# EAGLE design Grove - Speaker v1.0 (EAGLE 6.3)
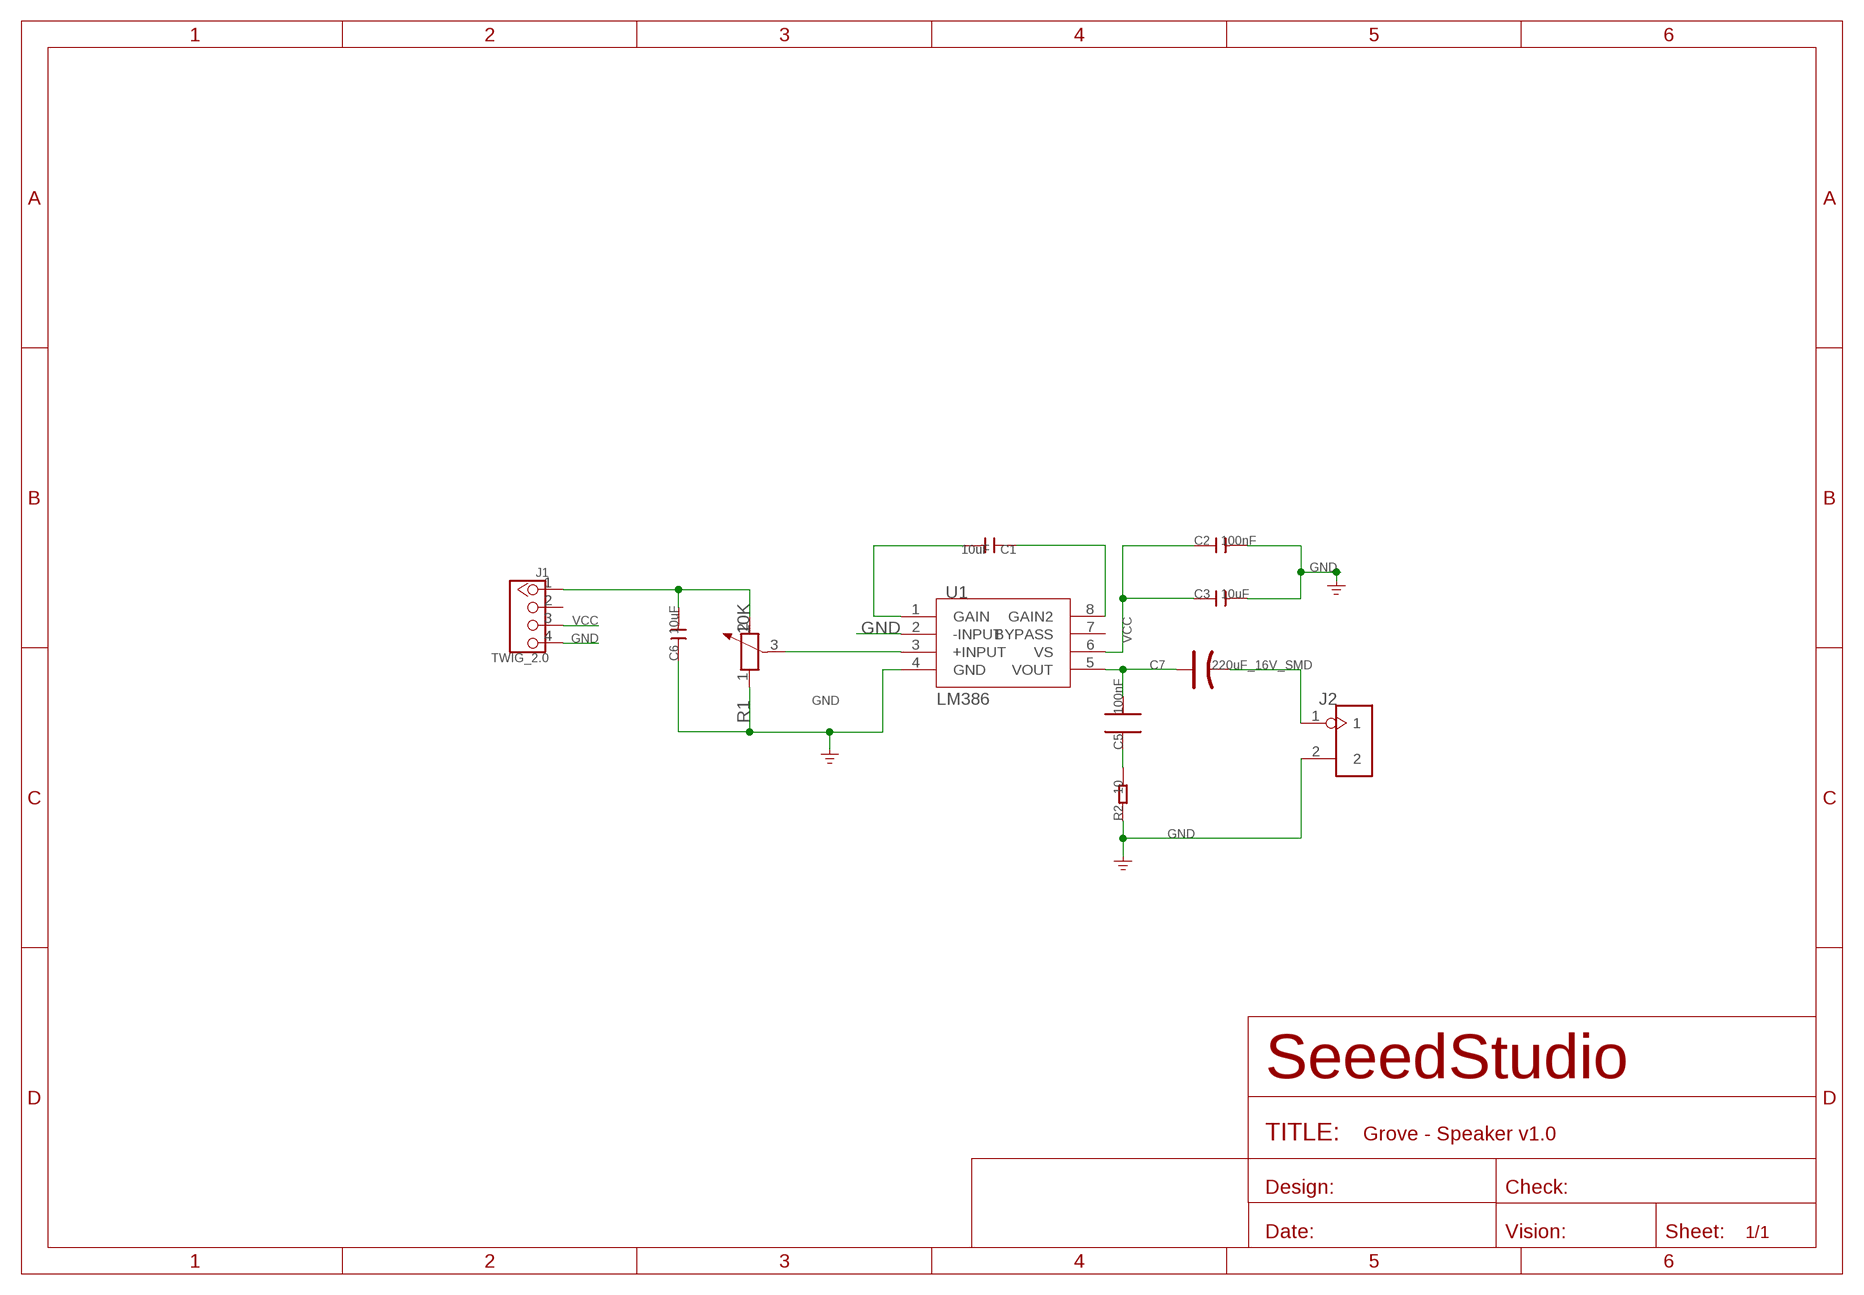
[diagram p0: schematic, sheet 1]

## Parts
C1  10uF  C-0805  [C0805]
C2  100nF  C-0603  [C0603]
C3  10uF  C-0805  [C0805]
C5  100nF  C0603  [0603]
C6  10uF  C-0805  [C0805]
C7  220uF_16V_SMD  CAP-ELECTRO-E  [ELECTRO-SMD-E-7.8MM]
J1  TWIG_2.0  [2.0_1X4]
J2  HEADER-2P-2.0  [2P-2.0]
R1  10K  R-POTENTIOMETER'3362'  [3P-SQUA-7X6.8]
R2  10  R-0603  [R0603]
U1  LM386  [SO08]

## Nets
GND: C2.2 C3.2 C6.1 J1.4 J2.2 R1.1 R2.1 U1.2(-INPUT) U1.4(GND)
N$1: C5.1 R2.2
N$2: C1.1 U1.8(GAIN2)
N$3: C7.- J2.1
N$4: R1.3 U1.3(+INPUT)
N$5: C6.2 J1.1 R1.2
N$6: C5.2 C7.+ U1.5(VOUT)
N$7: C1.2 U1.1(GAIN)
VCC: C2.1 C3.1 J1.3 U1.6(VS)
Unconnected: J1.2 U1.7(BYPASS)

## Library data of the parts
C1-C3 C6 = Discrete:C*: Ceramic Capacitors
C5 = CPT_SMD:C0603; C0603: 100N
C7 = Discrete:CAP*: Electrolytic Capacitors,Tantalum Capacitors and Super Capacitors
J1 = CONNECTER:TWIG_2.0
J2 = Connector:HEADER-2P
R1 = Discrete:R-POTENTIOMETER*: Potentiometer
R2 = Discrete:R*
U1 = seeedleo:LM386

## Board
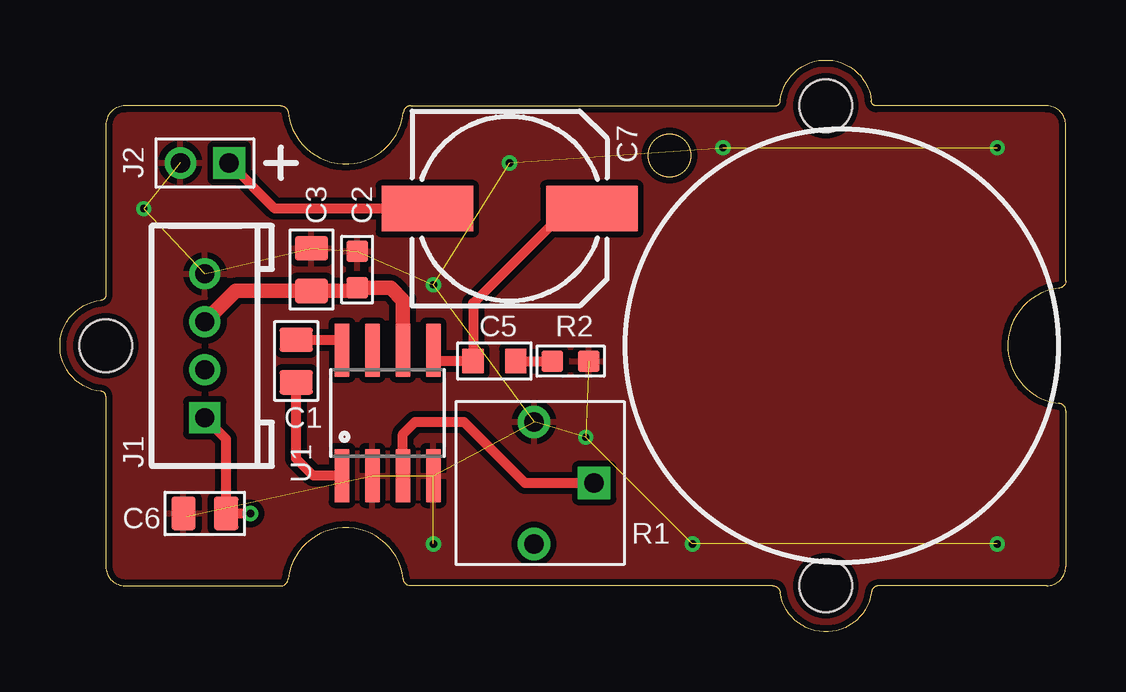
[diagram p1: board, top side]
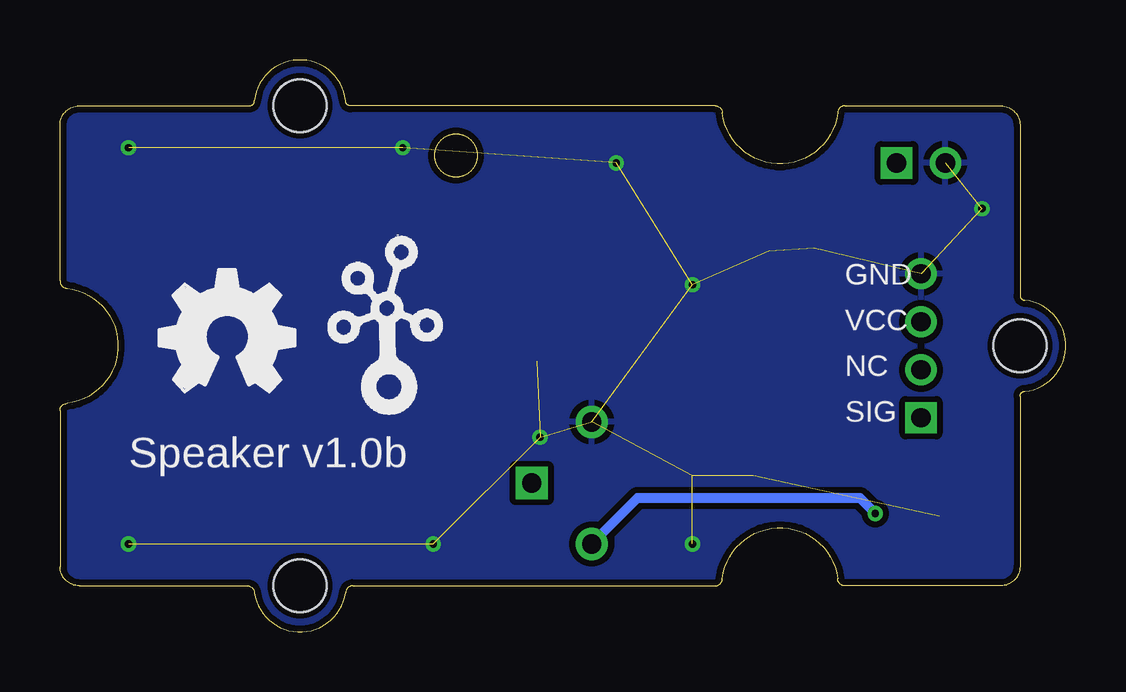
[diagram p2: board, bottom side, seen from below]

Size 41.91 x 23.83 mm. Coordinates in mm from the lower left corner, seen from the top.
Outline: circle at 25.4,19.86 radius 0.89
Copper layers (1*16): Top 0.035mm / dielectric 1.5mm / Bottom 0.035mm
Design rules "SeeedStudio_rule_no_angle_090911 *": minimum track width 6mil, minimum drill 12mil, track to track 6mil, track to pad 6mil, pad to pad 6mil, via to via 6mil, smd to smd 0mil, copper to edge 10mil, drill to drill 10mil, minimum pad ring 10mil, minimum via ring 6mil, stop-mask expansion 2mil, vias tented up to drill 25mil, thermal gap 10mil

### Footprints (pad centres in the part's own frame; a part is rotated, then mirrored left to right if it is on the bottom)
C0805 = smd 1.016 x 1.397: 1 -0.889,0; 2 0.889,0
C0603 = smd 0.889 x 0.889: 1 -0.762,0; 2 0.762,0
0603 = smd 0.889 x 1.016: 1 -0.889,0; 2 0.889,0
ELECTRO-SMD-E-7.8MM = smd 3.81 x 1.905: + 3.429,0; - -3.429,0
2.0_1X4 = drill 0.8 pad 1.27 square: 1 -3,0 | drill 0.8 pad 1.27: 2 -1,0; 3 1,0; 4 3,0
2P-2.0 = drill 0.813 pad 1.27 square: 1 -1.016,0 | drill 0.813 pad 1.27: 2 1.016,0
3P-SQUA-7X6.8 = drill 0.8 pad 1.35: 1 -2.54,-0.25; 2 2.54,-0.25 | drill 0.8 pad 1.35 square: 3 0,2.25
R0603 = smd 0.889 x 0.889: 1 -0.762,0; 2 0.762,0
SO08 = smd 0.61 x 2.21: 1 -1.905,-2.616; 2 -0.635,-2.616; 3 0.635,-2.616; 4 1.905,-2.616; 5 1.905,2.616; 6 0.635,2.616; 7 -0.635,2.616; 8 -1.905,2.616
2U-DIM-W/DRILL = hole 2.2: -10,-10; -10,10; 20,0

### Placement (x,y rotation side)
C1  9.84,11.29 270 top
C2  12.38,15.1 90 top
C3  10.48,15.1 90 top
C5  18.1,11.29 180 top
C6  6.03,4.94 0 top
C7  18.73,17.64 0 top
J1  6.03,11.92 90 top
J2  6.03,19.54 180 top
R1  20,6.21 270 top
R2  21.27,11.29 180 top
U1  13.65,9.13 0 top
U$2  [2U-DIM-W/DRILL]  21.91,11.92 180 top
U$3  [OSHW_FILLX200_NOTEXT]  37.78,10.02 0 bottom
U$4  [TWIGLOGO]  28.26,10.02 0 bottom

### Tracks (layer width: path | path; a pad name or v marks a point on that pad's centre or on a via)
GND  (via drill 0.3 pad 0.64)  (17 unrouted)
  Top 0.406: 5.27,4.81 C6.1
  other vias: 15.56,14.46 15.56,3.67 21.91,8.11 18.73,19.54 39.05,3.67 39.05,20.18 26.35,3.67 3.49,17.64 27.62,20.18
  pour Top (isolate 0.254): 0.32,-0.14 -0.32,-0.14 -0.32,23.99 42.23,23.99 42.23,-0.14 0.45,-0.14
  pour Bottom (isolate 0.254): 0.32,-0.14 -0.32,-0.14 -0.32,23.99 42.23,23.99 42.23,-0.14 0.45,-0.14
N$1
  Top 0.406: C5.1 R2.2
N$2
  Top 0.406: C1.1 11.62,12.18 11.75,12.3 U1.8
N$3
  Top 0.406: C7.- 8.95,17.64 J2.1
N$4
  Top 0.406: U1.3 14.29,8.24 14.8,8.75 16.83,8.75 19.37,6.21 R1.3
N$5  (via drill 0.3 pad 0.64)
  Top 0.406: J1.1 6.92,8.03 C6.2 v7.94,4.94
  Bottom 0.406: R1.2 17.85,5.57 8.57,5.57 v7.94,4.94
N$6
  Top 0.406: C7.+ 21.15,17.64 17.21,13.7 17.21,11.41 17.34,11.29 C5.2 15.69,11.29 15.56,11.41 U1.5
N$7
  Top 0.406: U1.1 10.55,6.51 9.84,7.22 C1.2
VCC
  Top 0.61: J1.3 7.32,14.21 C3.1 12.26,14.21 C2.1 13.78,14.33 14.29,13.83 U1.6

### Text on the board
bPlace: GND | VCC | NC | SIG | Speaker v1.0b